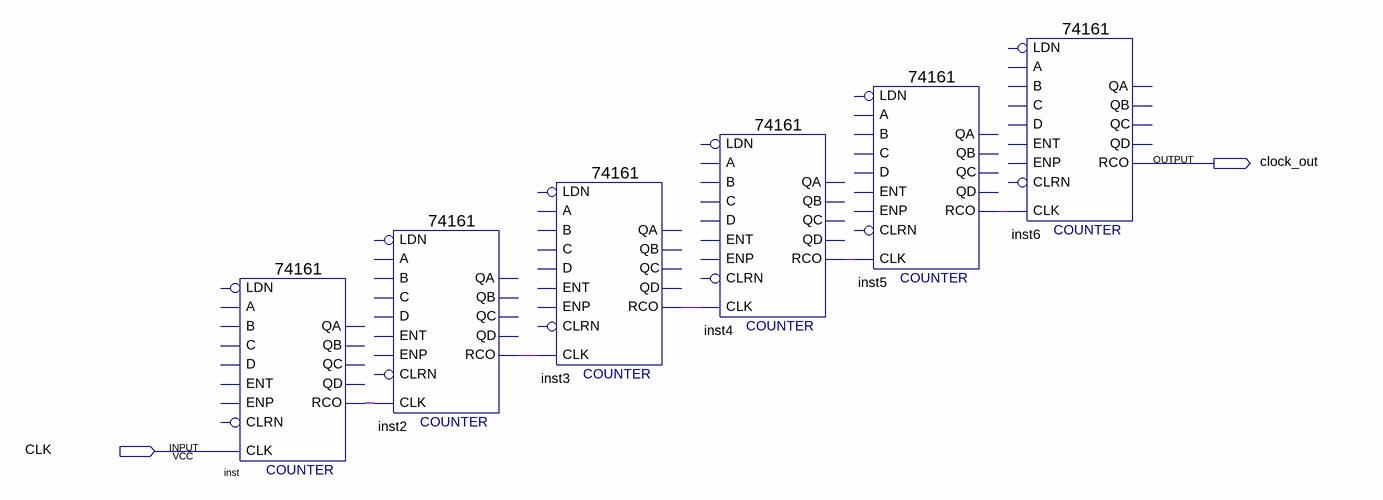
[diagram p0: schematic sheet]
// Quartus schematic tf_clk_16_6.bdf as structural Verilog: 6 symbols, 2 pins
module tf_clk_16_6 (
  input  CLK,
  output clock_out
);

  wire inst2_rco, inst3_rco, inst4_rco, inst5_rco, inst_rco;

  \74161  inst (.CLK(CLK), .RCO(inst_rco));  // open: CLRN, ENP, LDN, A, D, ENT, B, C, QD, QC, QB, QA
  \74161  inst2 (.CLK(inst_rco), .RCO(inst2_rco));  // open: CLRN, ENP, LDN, A, D, ENT, B, C, QD, QC, QB, QA
  \74161  inst3 (.CLK(inst2_rco), .RCO(inst3_rco));  // open: CLRN, ENP, LDN, A, D, ENT, B, C, QD, QC, QB, QA
  \74161  inst4 (.CLK(inst3_rco), .RCO(inst4_rco));  // open: CLRN, ENP, LDN, A, D, ENT, B, C, QD, QC, QB, QA
  \74161  inst5 (.CLK(inst4_rco), .RCO(inst5_rco));  // open: CLRN, ENP, LDN, A, D, ENT, B, C, QD, QC, QB, QA
  \74161  inst6 (.CLK(inst5_rco), .RCO(clock_out));  // open: CLRN, ENP, LDN, A, D, ENT, B, C, QD, QC, QB, QA
endmodule
